# EAGLE design BLDC_ESC (EAGLE 9.5.2)
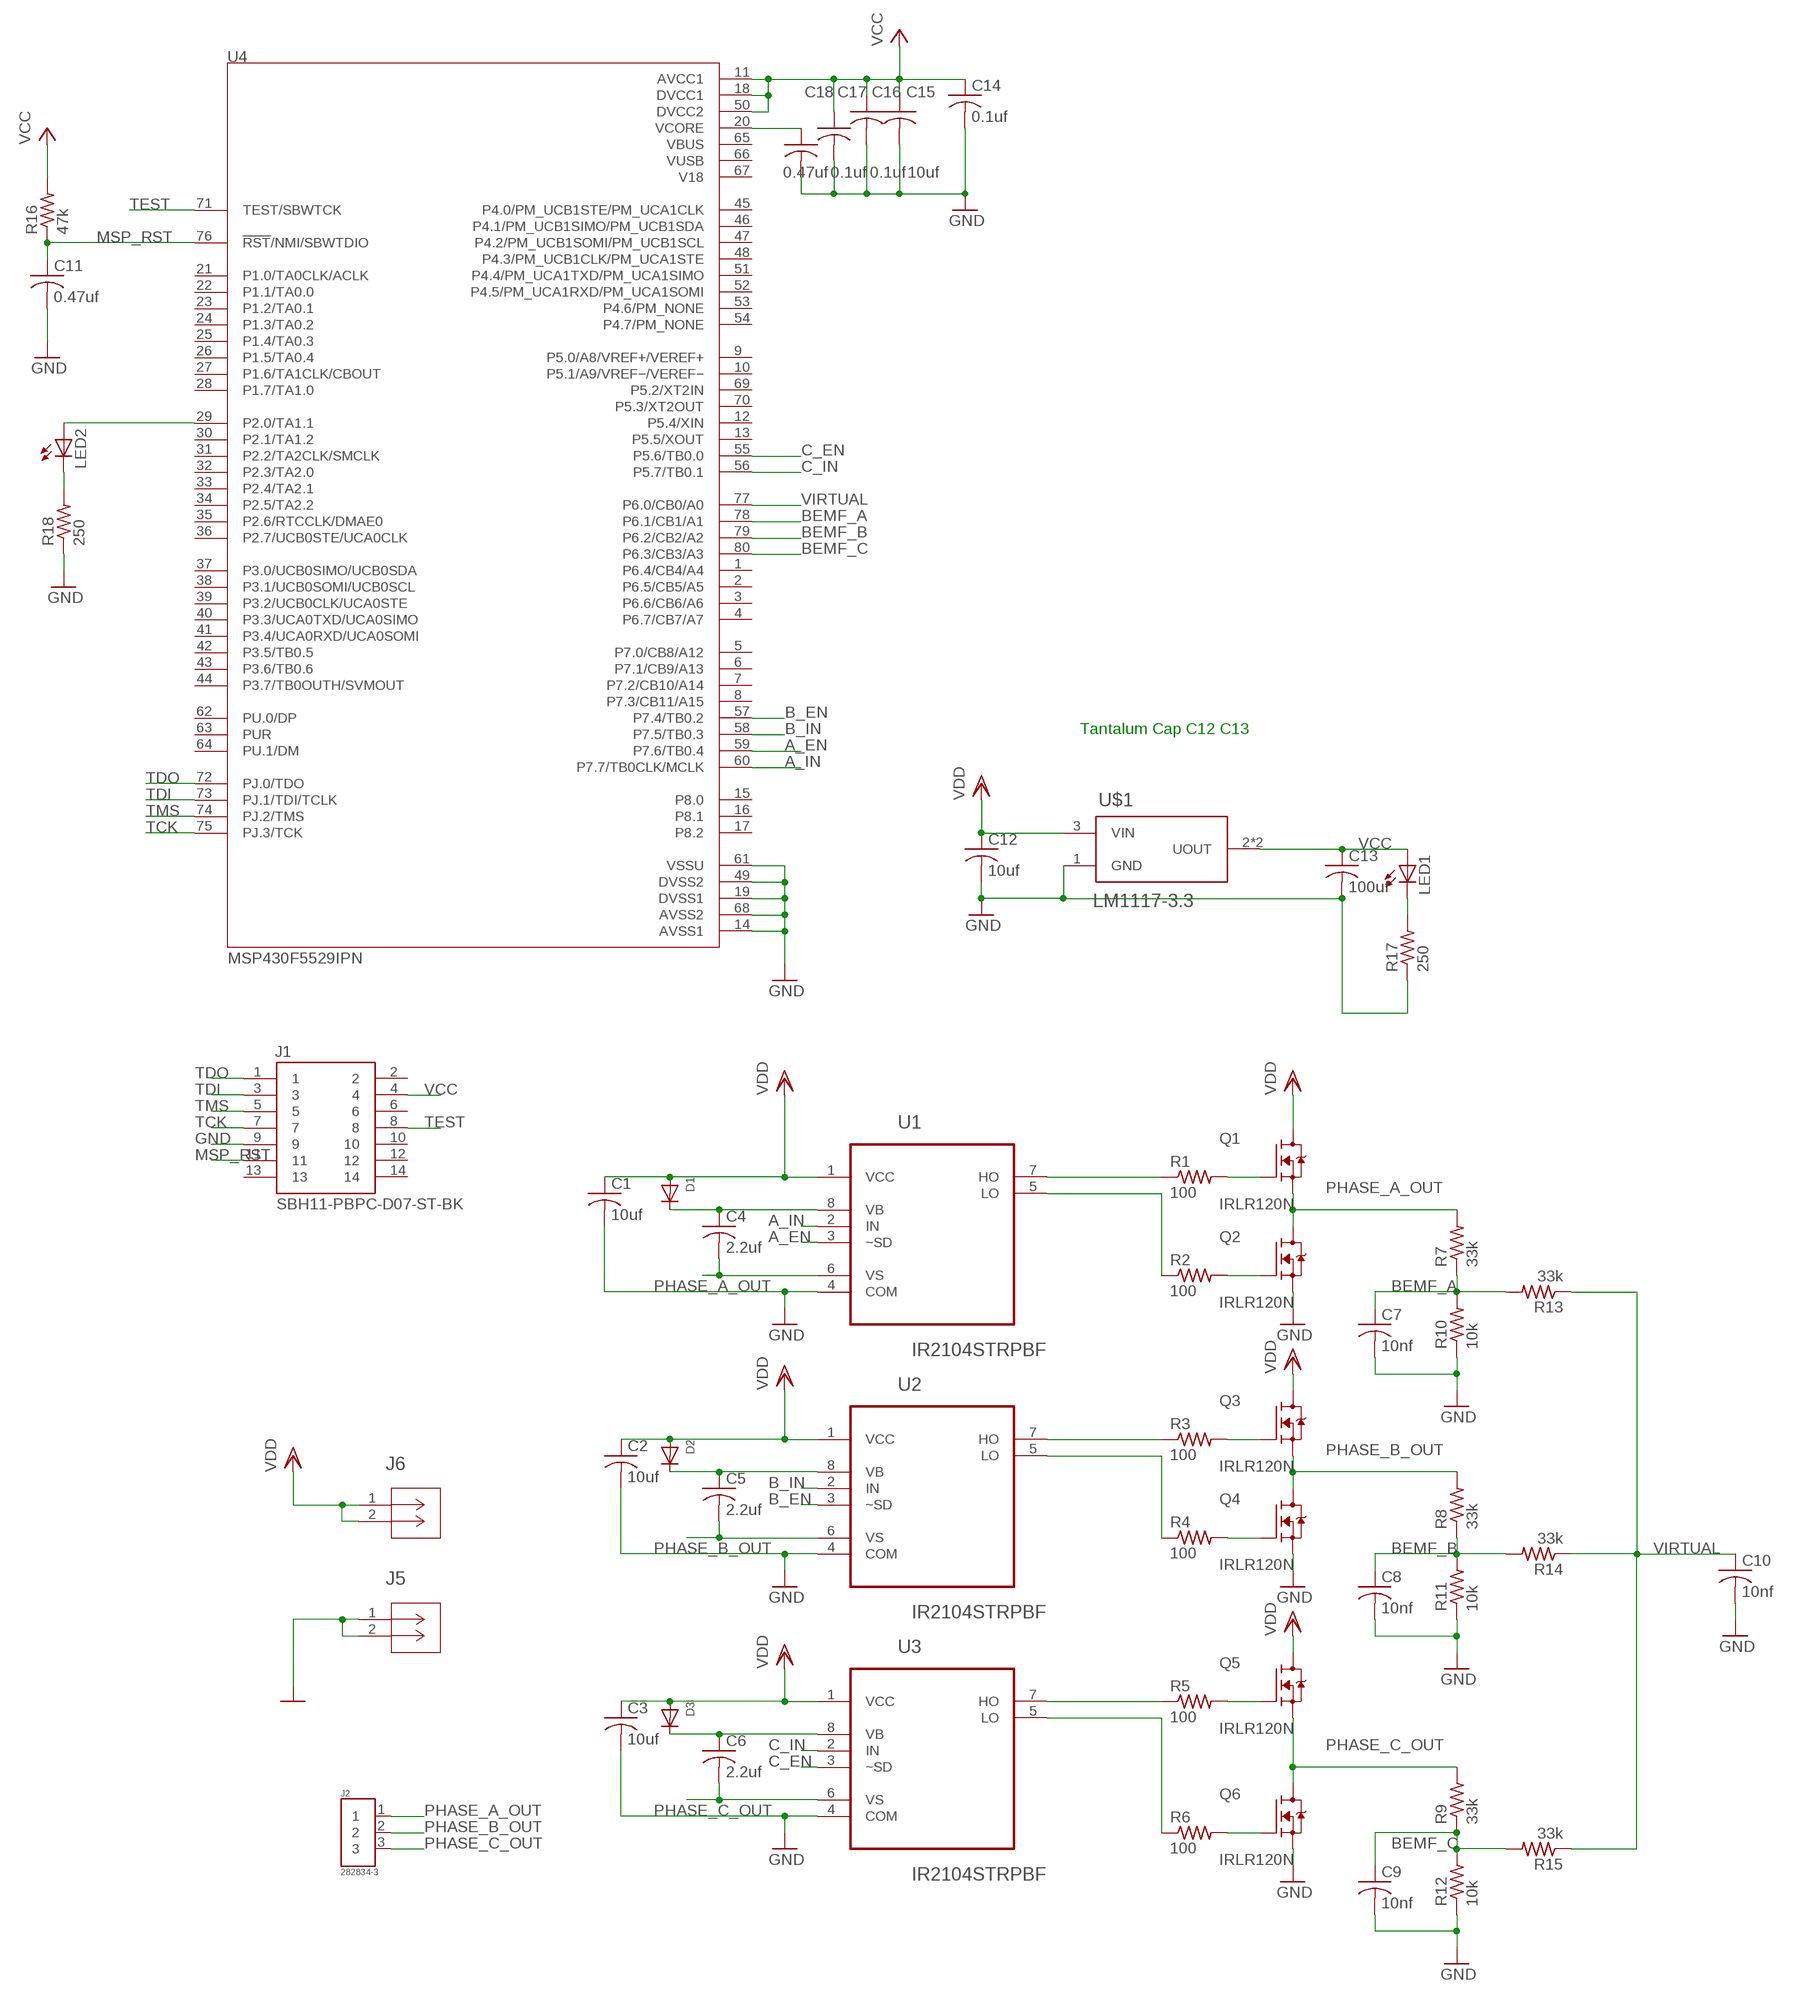
[diagram p0: schematic, sheet 1]

## Parts
C1  10uf  C-USC0805K  [C0805K]
C2  10uf  C-USC0805K  [C0805K]
C3  10uf  C-USC0805K  [C0805K]
C4  2.2uf  C-USC0805K  [C0805K]
C5  2.2uf  C-USC0805K  [C0805K]
C6  2.2uf  C-USC0805K  [C0805K]
C7  10nf  C-USC0805  [C0805]
C8  10nf  C-USC0805  [C0805]
C9  10nf  C-USC0805  [C0805]
C10  10nf  C-USC0805  [C0805]
C11  0.47uf  C-USC0805  [C0805]
C12  10uf  C-USC0805  [C0805]
C13  100uf  C-USC0805  [C0805]
C14  0.1uf  C-USC0805  [C0805]
C15  10uf  C-USC0805  [C0805]
C16  0.1uf  C-USC0805  [C0805]
C17  0.1uf  C-USC0805  [C0805]
C18  0.47uf  C-USC0805  [C0805]
D1  DIODESOD-123  [SOD-123]
D2  DIODESOD-123  [SOD-123]
D3  DIODESOD-123  [SOD-123]
J1  SBH11-PBPC-D07-ST-BK  [SULLINS_SBH11-PBPC-D07-ST-BK]
J2  282834-3  [TE_282834-3]
J5  105-1103-001  [CONN_105-1102-001]
J6  105-1103-001  [CONN_105-1102-001]
LED1  LEDCHIPLED_0805  [CHIPLED_0805]
LED2  LEDCHIPLED_0805  [CHIPLED_0805]
Q1  IRLR120N  [DPAK229P990X239-3N]
Q2  IRLR120N  [DPAK229P990X239-3N]
Q3  IRLR120N  [DPAK229P990X239-3N]
Q4  IRLR120N  [DPAK229P990X239-3N]
Q5  IRLR120N  [DPAK229P990X239-3N]
Q6  IRLR120N  [DPAK229P990X239-3N]
R1  100  R-US_R0805  [R0805]
R2  100  R-US_R0805  [R0805]
R3  100  R-US_R0805  [R0805]
R4  100  R-US_R0805  [R0805]
R5  100  R-US_R0805  [R0805]
R6  100  R-US_R0805  [R0805]
R7  33k  R-US_R0805  [R0805]
R8  33k  R-US_R0805  [R0805]
R9  33k  R-US_R0805  [R0805]
R10  10k  R-US_R0805  [R0805]
R11  10k  R-US_R0805  [R0805]
R12  10k  R-US_R0805  [R0805]
R13  33k  R-US_R0805  [R0805]
R14  33k  R-US_R0805  [R0805]
R15  33k  R-US_R0805  [R0805]
R16  47k  R-US_M0805  [M0805]
R17  250  R-US_R0805  [R0805]
R18  250  R-US_R0805  [R0805]
U1  IR2104STRPBF  [SOIC127P600X175-8N]
U2  IR2104STRPBF  [SOIC127P600X175-8N]
U3  IR2104STRPBF  [SOIC127P600X175-8N]
U4  MSP430F5529IPN  [QFP50P1400X1400X160-80N]
U$1  LM1117-3.3  [SOT-223]

## Nets
A_EN: U1.3(~SD) U4.59(P7.6/TB0.4)
A_IN: U1.2(IN) U4.60(P7.7/TB0CLK/MCLK)
B_EN: U2.3(~SD) U4.57(P7.4/TB0.2)
B_IN: U2.2(IN) U4.58(P7.5/TB0.3)
BEMF_A: C7.1 R7.1 R10.2 R13.2 U4.78(P6.1/CB1/A1)
BEMF_B: C8.1 R8.1 R11.2 R14.2 U4.79(P6.2/CB2/A2)
BEMF_C: C9.1 R9.1 R12.2 R15.2 U4.80(P6.3/CB3/A3)
C_EN: U3.3(~SD) U4.55(P5.6/TB0.0)
C_IN: U3.2(IN) U4.56(P5.7/TB0.1)
GND: C1.2 C2.2 C3.2 C7.2 C8.2 C9.2 C10.2 C11.2 C12.2 C13.2 C14.2 C15.2 C16.2 C17.2 C18.2 J1.9 J5.1 J5.2 Q2.2(S) Q4.2(S) Q6.2(S) R10.1 R11.1 R12.1 R17.1 R18.1 U1.4(COM) U2.4(COM) U3.4(COM) U4.14(AVSS1) U4.19(DVSS1) U4.49(DVSS2) U4.61(VSSU) U4.68(AVSS2) U$1.1(GND)
MSP_RST: C11.1 J1.11 R16.1 U4.76(!RST!/NMI/SBWTDIO)
N$1: Q1.1(G) R1.2
N$2: R1.1 U1.7(HO)
N$3: R2.1 U1.5(LO)
N$4: Q2.1(G) R2.2
N$5: C6.1 D3.C U3.8(VB)
N$6: C5.1 D2.C U2.8(VB)
N$7: C4.1 D1.C U1.8(VB)
N$8: R3.1 U2.7(HO)
N$9: Q3.1(G) R3.2
N$10: R4.1 U2.5(LO)
N$11: Q4.1(G) R4.2
N$12: R5.1 U3.7(HO)
N$13: Q5.1(G) R5.2
N$14: R6.1 U3.5(LO)
N$15: Q6.1(G) R6.2
N$16: LED1.C R17.2
N$17: LED2.A U4.29(P2.0/TA1.1)
N$18: LED2.C R18.2
N$19: C18.1 U4.20(VCORE)
PHASE_A_OUT: C4.2 J2.1 Q1.2(S) Q2.3(D) R7.2 U1.6(VS)
PHASE_B_OUT: C5.2 J2.2 Q3.2(S) Q4.3(D) R8.2 U2.6(VS)
PHASE_C_OUT: C6.2 J2.3 Q5.2(S) Q6.3(D) R9.2 U3.6(VS)
TCK: J1.7 U4.75(PJ.3/TCK)
TDI: J1.3 U4.73(PJ.1/TDI/TCLK)
TDO: J1.1 U4.72(PJ.0/TDO)
TEST: J1.8 U4.71(TEST/SBWTCK)
TMS: J1.5 U4.74(PJ.2/TMS)
VCC: C13.1 C14.1 C15.1 C16.1 C17.1 J1.4 LED1.A R16.2 U4.11(AVCC1) U4.18(DVCC1) U4.50(DVCC2) U$1.2(UOUT) U$1.4(UOUT)
VDD: C1.1 C2.1 C3.1 C12.1 D1.A D2.A D3.A J6.1 J6.2 Q1.3(D) Q3.3(D) Q5.3(D) U1.1(VCC) U2.1(VCC) U3.1(VCC) U$1.3(VIN)
VIRTUAL: C10.1 R13.1 R14.1 R15.1 U4.77(P6.0/CB0/A0)
Unconnected: J1.2 J1.6 J1.10 J1.12 J1.13 J1.14 U4.1(P6.4/CB4/A4) U4.2(P6.5/CB5/A5) U4.3(P6.6/CB6/A6) U4.4(P6.7/CB7/A7) U4.5(P7.0/CB8/A12) U4.6(P7.1/CB9/A13) U4.7(P7.2/CB10/A14) U4.8(P7.3/CB11/A15) U4.9(P5.0/A8/VREF+/VEREF+) U4.10(P5.1/A9/VREF−/VEREF−) U4.12(P5.4/XIN) U4.13(P5.5/XOUT) U4.15(P8.0) U4.16(P8.1) U4.17(P8.2) U4.21(P1.0/TA0CLK/ACLK) U4.22(P1.1/TA0.0) U4.23(P1.2/TA0.1) U4.24(P1.3/TA0.2) U4.25(P1.4/TA0.3) U4.26(P1.5/TA0.4) U4.27(P1.6/TA1CLK/CBOUT) U4.28(P1.7/TA1.0) U4.30(P2.1/TA1.2) U4.31(P2.2/TA2CLK/SMCLK) U4.32(P2.3/TA2.0) U4.33(P2.4/TA2.1) U4.34(P2.5/TA2.2) U4.35(P2.6/RTCCLK/DMAE0) U4.36(P2.7/UCB0STE/UCA0CLK) U4.37(P3.0/UCB0SIMO/UCB0SDA) U4.38(P3.1/UCB0SOMI/UCB0SCL) U4.39(P3.2/UCB0CLK/UCA0STE) U4.40(P3.3/UCA0TXD/UCA0SIMO) U4.41(P3.4/UCA0RXD/UCA0SOMI) U4.42(P3.5/TB0.5) U4.43(P3.6/TB0.6) U4.44(P3.7/TB0OUTH/SVMOUT) U4.45(P4.0/PM_UCB1STE/PM_UCA1CLK) U4.46(P4.1/PM_UCB1SIMO/PM_UCB1SDA) U4.47(P4.2/PM_UCB1SOMI/PM_UCB1SCL) U4.48(P4.3/PM_UCB1CLK/PM_UCA1STE) U4.51(P4.4/PM_UCA1TXD/PM_UCA1SIMO) U4.52(P4.5/PM_UCA1RXD/PM_UCA1SOMI) U4.53(P4.6/PM_NONE) U4.54(P4.7/PM_NONE) U4.62(PU.0/DP) U4.63(PUR) U4.64(PU.1/DM) U4.69(P5.2/XT2IN) U4.70(P5.3/XT2OUT)

## Notes on the sheet
- Tantalum Cap C12 C13

## Power pins joined to a net without a drawn wire
V18: U4.67(V18)
VBUS: U4.65(VBUS)
VUSB: U4.66(VUSB)

## Library data of the parts
C1-C6 C12-C18 = adafruit:C-US: CAPACITOR, American symbol
C7-C11 = rcl:C-US: CAPACITOR, American symbol; SPICEPREFIX: C
D1-D3 = adafruit:DIODE: Diode SMADIODE - SMA Surface Mount Package 20V 1A Schottky Diode Digikey: 641-1014-6-ND DO-1N4148 - Through Hole Small Current Diode SOD-123 20V 1 A (.5mV Vf) Schottky Diode - Digikey: MBRX120TPMSCT-ND SOD-323 10V 570mA (.38mV Vf, 3ns) Schottky Diode - Digikey: ZLLS410CT-ND SOD-523 30V 30mA Schottky Diode (RB751S-40TE61) - Digikey: RB751S-40TE61CT-ND SOT23-R/W - SOT23 Package (R = Solder Paste/Reflow Ovens, W = Hand-Soldering) BAT54Film 40V 300mA - Digikey: 497-7162-1-ND
J1 = SBH11-PBPC-D07-ST-BK:SBH11-PBPC-D07-ST-BK: 14 Position Total Dual Row 2.54 mm Pitch Straight Male Shrouded Box Header; DESCRIPTION: Connector Header Through Hole 14 position 0.100 (2.54mm); DIGI-KEY_PART_NUMBER: S9170-ND; DIGIKEY-PURCHASE-URL: https://snapeda.com/shop?store=DigiKey&id=229418; MF: Sullins Connector; MP: SBH11-PBPC-D07-ST-BK; PACKAGE: None
J2 = 282834-3:282834-3: Conn; Term Blk; PCB; Wire Receptacle; 3; 2.54mm; 30-16AWG; Green; 10A; 150V; M1.6; ARROW_AMERICAS-PURCHASE-URL: https://snapeda.com/shop?store=Arrow+Americas&id=398089; COMMENT: 282834-3; DESCRIPTION: 3 Position Wire to Board Terminal Block Horizontal with Board 0.100 (2.54mm); DIGI-KEY_PART_NUMBER: A98334-ND; DIGIKEY-PURCHASE-URL: https://snapeda.com/shop?store=DigiKey&id=398089; EU_ROHS_COMPLIANCE: Compliant with Exemptions; MF: TE Connectivity; MOUSER-PURCHASE-URL: https://snapeda.com/shop?store=Mouser&id=398089; MP: 282834-3; PACKAGE: None
J5 J6 = CinchConnectivitySolution:105-1103-001; BUILT_BY: EMA_Matt; COPYRIGHT: Copyright (C) 2018 Accelerated Designs. All rights reserved; MANUFACTURER_PART_NUMBER: 105-1103-001; SOURCELIBRARY: Cinch_Connectivity_Solutions_2019-12-17; VENDOR: Cinch Connectivity Solutions
LED1 LED2 = adafruit:LED: LED OSRAM: - CHIPLED LG R971, LG N971, LY N971, LG Q971, LY Q971, LO R971, LY R971 LH N974, LH R974 LS Q976, LO Q976, LY Q976 LO Q996 - Hyper CHIPLED LW Q18S LB Q993, LB Q99A, LB R99A - SideLED LS A670, LO A670, LY A670, LG A670, LP A670 LB A673, LV A673, LT A673, LW A673 LH A674 LY A675 LS A676, LA A676, LO A676, LY A676, LW A676 LS A679, LY A679, LG A679 - Hyper Micro SIDELED® LS Y876, LA Y876, LO Y876, LY Y876 LT Y87S - SmartLED LW L88C, LW L88S LB L89C, LB L89S, LG L890 LS L89K, LO L89K, LY L89K LS L896, LA L896, LO L896, LY L896 - TOPLED LS T670, LO T670, LY T670, LG T670, LP T670 LSG T670, LSP T670, LSY T670, LOP T670, LYG T670 LG T671, LOG T671, LSG T671 LB T673, LV T673, LT T673, LW T673 LH T674 LS T676, LA T676, LO T676, LY T676, LB T676, LH T676, LSB T676, LW T676 LB T67C, LV T67C, LT T67C, LS T67K, LO T67K, LY T67K, LW E67C LS E67B, LA E67B, LO E67B, LY E67B, LB E67C, LV E67C, LT E67C LW T67C LS T679, LY T679, LG T679 LS T770, LO T770, LY T770, LG T770, LP T770 LB T773, LV T773, LT T773, LW T773 LH T774 LS E675, LA E675, LY E675, LS T675 LS T776, LA T776, LO T776, LY T776, LB T776 LHGB T686 LT T68C, LB T68C - Hyper Mini TOPLED® LB M676 - Mini TOPLED Santana® LG M470 LS M47K, LO M47K, LY M47K Source: http://www.osram.convergy.de/
Q1-Q6 = IRLR120N:IRLR120N: 100V Single N-Channel HEXFET Power MOSFET in a D-Pak package; DESCRIPTION: 100V Single N-Channel HEXFET Power MOSFET in a D-Pak package; DIGI-KEY_PART_NUMBER: IRLR120NPBFCT-ND; DIGI-KEY_PURCHASE_URL: https://www.digikey.com/product-detail/en/infineon-technologies/IRLR120NTRPBF/IRLR120NPBFCT-ND/812548?utm_source=snapeda&utm_medium=aggregator&utm_campaign=symbol; MF: Infineon Technologies; MP: IRLR120N; PACKAGE: TO-252 International Rectifier
R1-R18 = adafruit:R-US_: RESISTOR, American symbol
U1-U3 = IR2104STRPBF:IR2104STRPBF: HALF-BRIDGE DRIVER; DESCRIPTION: Half Bridge Driver, Single Input Plus Inverting Shutdown Pin, Fixed 520ns Deadtime in a 8-Lead package; DIGI-KEY_PART_NUMBER: IR2104SPBFCT-ND; DIGI-KEY_PURCHASE_URL: https://www.digikey.com/product-detail/en/infineon-technologies/IR2104STRPBF/IR2104SPBFCT-ND/812609?utm_source=snapeda&utm_medium=aggregator&utm_campaign=symbol; MF: Infineon Technologies; MP: IR2104STRPBF; PACKAGE: SOIC-8 Infineon
U4 = MSP430F5529IPN:MSP430F5529IPN: 16-Bit Ultra-Low-Power Microcontroller, 128KB Flash, 8KB RAM, USB, 12Bit ADC, 2 USCIs, 32Bit HW MPY 80-LQFP -40 to 85; ARROW_AMERICAS-PURCHASE-URL: https://snapeda.com/shop?store=Arrow+Americas&id=100005; AVAILABILITY: Unavailable; DESCRIPTION: CPUXV2 MSP430F5xx Microcontroller IC 16-Bit 25MHz 128KB (128K x 8) FLASH 80-LQFP (12x12); DIGIKEY-PURCHASE-URL: https://snapeda.com/shop?store=DigiKey&id=100005; MF: Texas Instruments; MOUSER-PURCHASE-URL: https://snapeda.com/shop?store=Mouser&id=100005; MP: MSP430F5529IPN; PACKAGE: LQFP-80 Texas Instruments; PRICE: None
U$1 = LM1117-3.3:LM1117-3.3; AVAILABILITY: Unavailable; DESCRIPTION: Linear Voltage Regulator IC 1 Output 800mA SOT-223-4; MF: Texas Instruments; MP: LM1117-3.3; PACKAGE: SOT-223-4 Texas Instruments; PRICE: None

## Board
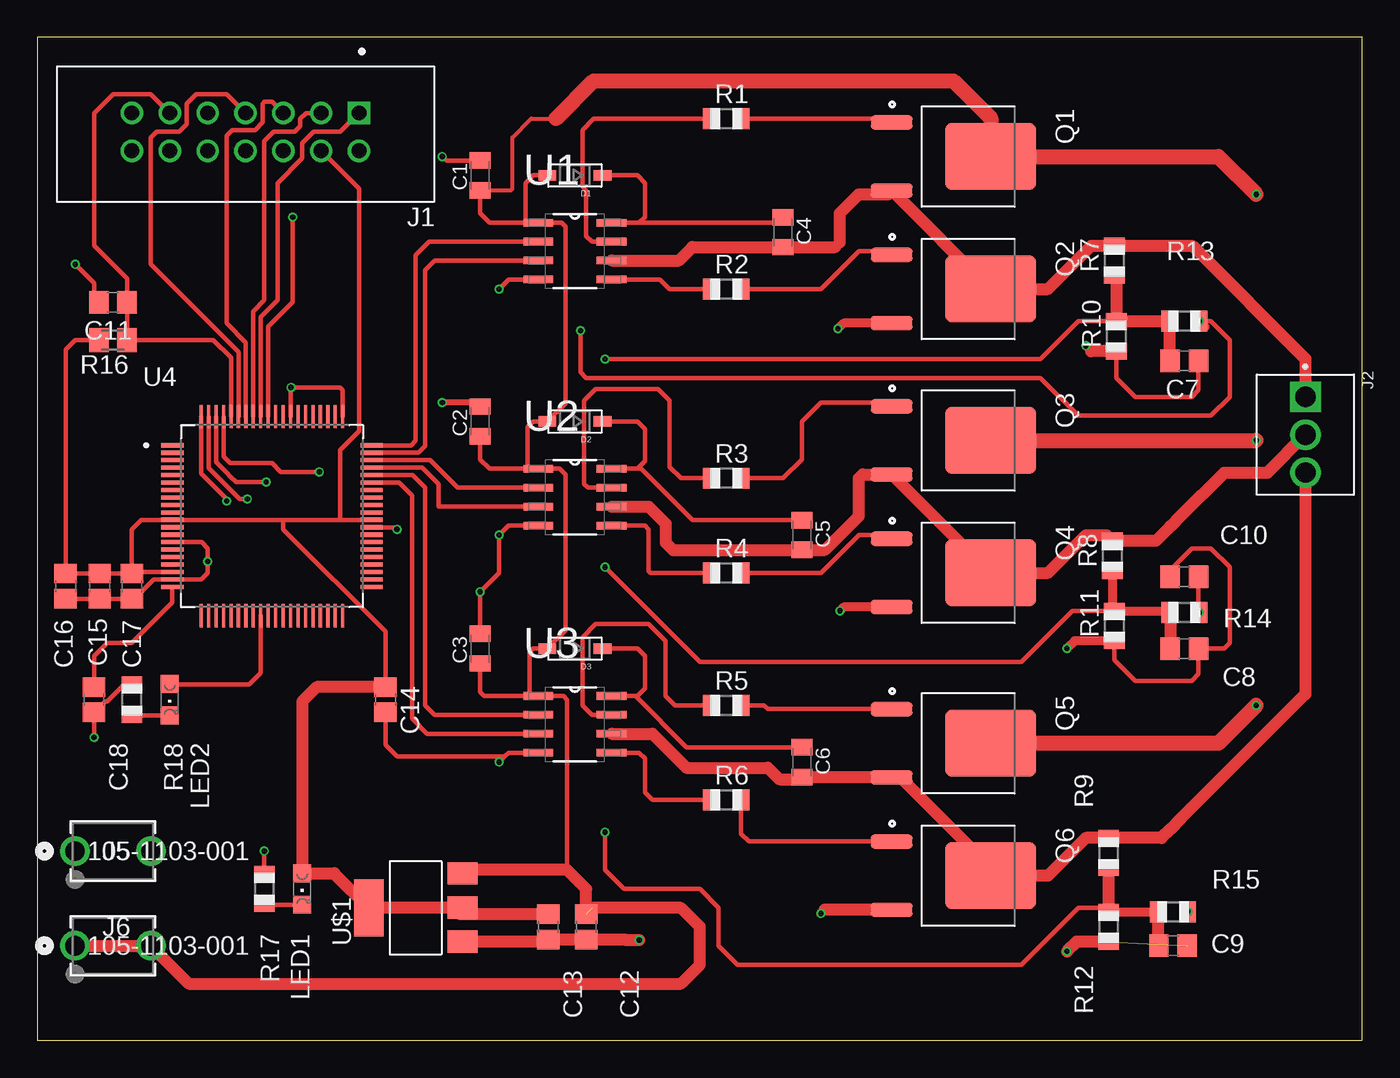
[diagram p1: board, top side]
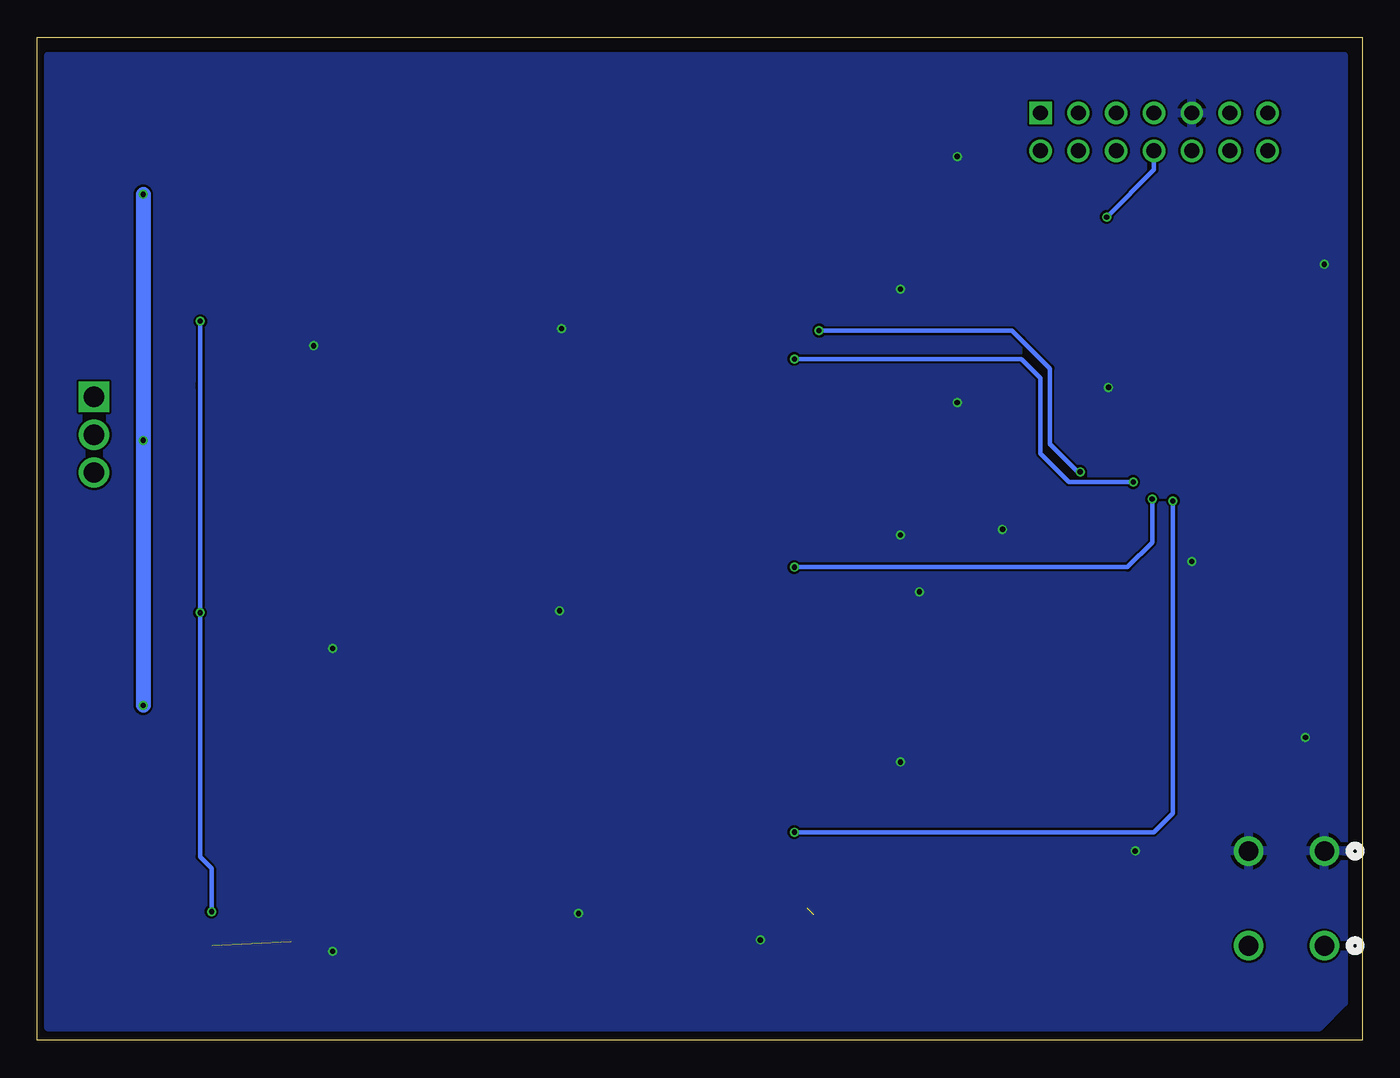
[diagram p2: board, bottom side, seen from below]

Size 88.9 x 67.31 mm. Coordinates in mm from the lower left corner, seen from the top.
Outline: 0,0 88.9,0 88.9,67.31 0,67.31 0,0
Copper layers (1*16): Top 0.035559375mm / dielectric 1.6mm / Bottom 0.035559375mm
Design rules "oshpark-2layer": minimum track width 6mil, minimum drill 10mil, track to track 6mil, track to pad 6mil, pad to pad 6mil, via to via 6mil, smd to smd 6mil, copper to edge 15mil, drill to drill 6mil, minimum pad ring 5mil, minimum via ring 5mil, stop-mask expansion 2.5mil, vias tented up to drill 0mil, thermal gap 10mil

### Footprints (pad centres in the part's own frame; a part is rotated, then mirrored left to right if it is on the bottom)
C0805K = smd 1.1 x 1.4: 1 -1,0; 2 1,0
C0805 = smd 1.3 x 1.5: 1 -0.95,0; 2 0.95,0
C0805' = smd 1.3 x 1.5: 1 -0.85,0; 2 0.85,0
SOD-123 = smd 1.2 x 0.7: A 1.85,0; C -1.85,0
SULLINS_SBH11-PBPC-D07-ST-BK = drill 1 square: 1 -7.62,-1.27 | drill 1: 2 -7.62,1.27; 3 -5.08,-1.27; 4 -5.08,1.27; 5 -2.54,-1.27; 6 -2.54,1.27; 7 0,-1.27; 8 0,1.27; 9 2.54,-1.27; 10 2.54,1.27; 11 5.08,-1.27; 12 5.08,1.27; 13 7.62,-1.27; 14 7.62,1.27
TE_282834-3 = drill 1.36 square: 1 0,0 | drill 1.36: 2 2.54,0; 3 5.08,0
CONN_105-1102-001 = drill 1.321 pad 1.829: 1 0,0; 2 5.08,0
CHIPLED_0805 = smd 1.2 x 1.2: A 0,-1.05; C 0,1.05
DPAK229P990X239-3N = smd 0.97 x 2.83: 1 -2.29,-4.14; 2 2.29,-4.14 | smd 4.49 x 6.1: 3 0,2.51
R0805 = smd 1.1 x 1.4: 1 -1,0; 2 1,0
M0805 = smd 1.3 x 1.6: 1 -0.95,0; 2 0.95,0
SOIC127P600X175-8N = smd 1.981 x 0.508: 1 -2.464,1.905; 2 -2.464,0.635; 3 -2.464,-0.635; 4 -2.464,-1.905; 5 2.464,-1.905; 6 2.464,-0.635; 7 2.464,0.635; 8 2.464,1.905
QFP50P1400X1400X160-80N = smd 1.56 x 0.28: 1 -6.68,4.75; 2 -6.68,4.25; 3 -6.68,3.75; 4 -6.68,3.25; 5 -6.68,2.75; 6 -6.68,2.25; 7 -6.68,1.75; 8 -6.68,1.25; 9 -6.68,0.75; 10 -6.68,0.25; 11 -6.68,-0.25; 12 -6.68,-0.75; 13 -6.68,-1.25; 14 -6.68,-1.75; 15 -6.68,-2.25; 16 -6.68,-2.75; 17 -6.68,-3.25; 18 -6.68,-3.75; 19 -6.68,-4.25; 20 -6.68,-4.75; 41 6.68,-4.75; 42 6.68,-4.25; 43 6.68,-3.75; 44 6.68,-3.25; 45 6.68,-2.75; 46 6.68,-2.25; 47 6.68,-1.75; 48 6.68,-1.25; 49 6.68,-0.75; 50 6.68,-0.25; 51 6.68,0.25; 52 6.68,0.75; 53 6.68,1.25; 54 6.68,1.75; 55 6.68,2.25; 56 6.68,2.75; 57 6.68,3.25; 58 6.68,3.75; 59 6.68,4.25; 60 6.68,4.75 | smd 0.28 x 1.56: 21 -4.75,-6.68; 22 -4.25,-6.68; 23 -3.75,-6.68; 24 -3.25,-6.68; 25 -2.75,-6.68; 26 -2.25,-6.68; 27 -1.75,-6.68; 28 -1.25,-6.68; 29 -0.75,-6.68; 30 -0.25,-6.68; 31 0.25,-6.68; 32 0.75,-6.68; 33 1.25,-6.68; 34 1.75,-6.68; 35 2.25,-6.68; 36 2.75,-6.68; 37 3.25,-6.68; 38 3.75,-6.68; 39 4.25,-6.68; 40 4.75,-6.68; 61 4.75,6.68; 62 4.25,6.68; 63 3.75,6.68; 64 3.25,6.68; 65 2.75,6.68; 66 2.25,6.68; 67 1.75,6.68; 68 1.25,6.68; 69 0.75,6.68; 70 0.25,6.68; 71 -0.25,6.68; 72 -0.75,6.68; 73 -1.25,6.68; 74 -1.75,6.68; 75 -2.25,6.68; 76 -2.75,6.68; 77 -3.25,6.68; 78 -3.75,6.68; 79 -4.25,6.68; 80 -4.75,6.68
SOT-223 = smd 1.499 x 2.007: 1 -2.261,-3.15; 2 0.025,-3.15; 3 2.311,-3.15 | smd 3.81 x 2.007: 4 0,3.15

### Placement (x,y rotation side)
C1  29.72,58.04 90 top
C2  29.72,41.53 90 top
C3  29.72,26.29 90 top
C4  50.04,54.23 270 top
C5  51.31,33.91 270 top
C6  51.31,18.67 270 top
C7  76.96,45.59 0 top
C8  76.96,26.29 0 top
C9  76.2,6.35 0 top
C10  76.96,31.11 180 top
C11  5.08,49.53 180 top
C12  10uf  [C0805']  36.83,7.62 270 top
C13  100uf  [C0805']  34.29,7.62 270 top
C14  0.1uf  [C0805']  23.37,22.86 270 top
C15  10uf  [C0805']  4.19,30.48 270 top
C16  0.1uf  [C0805']  1.91,30.48 270 top
C17  0.1uf  [C0805']  6.35,30.48 270 top
C18  0.47uf  [C0805']  3.81,22.86 270 top
D1  36.07,58.04 180 top
D2  36.07,41.53 180 top
D3  36.07,26.29 180 top
J1  13.97,60.96 180 top
J2  85.09,43.18 270 top
J5  2.54,12.7 0 top
J6  2.54,6.35 0 top
LED1  17.78,10.16 180 top
LED2  8.89,22.86 180 top
Q1  61.47,59.31 270 top
Q2  61.47,50.42 270 top
Q3  61.47,40.26 270 top
Q4  61.47,31.37 270 top
Q5  61.47,19.94 270 top
Q6  61.47,11.05 270 top
R1  46.23,61.85 0 top
R2  46.23,50.42 0 top
R3  46.23,37.72 0 top
R4  46.23,31.37 0 top
R5  46.23,22.48 0 top
R6  46.23,16.13 0 top
R7  72.26,52.32 90 top
R8  72.14,32.51 90 top
R9  71.88,12.57 90 top
R10  72.39,47.24 90 top
R11  72.26,27.81 90 top
R12  71.88,7.62 90 top
R13  76.96,48.26 180 top
R14  76.96,28.7 180 top
R15  76.2,8.64 180 top
R16  5.08,46.99 180 top
R17  15.24,10.16 270 top
R18  6.35,22.86 270 top
U1  36.07,52.96 0 top
U2  36.07,36.45 0 top
U3  36.07,21.21 0 top
U4  15.75,35.18 0 top
U$1  25.4,8.89 90 top

### Tracks (layer width: path | path; a pad name or v marks a point on that pad's centre or on a via)
A_EN
  Top 0.305: U4.59 25.59,39.43 26.04,39.88 26.04,51.69 26.67,52.32 U1.3
A_IN
  Top 0.305: U4.60 25.07,39.93 25.4,40.26 25.4,52.7 26.29,53.59 U1.2
B_EN
  Top 0.305: U4.57 25.83,38.43 26.92,37.34 26.92,35.81 U2.3
B_IN
  Top 0.305: U4.58 26.35,38.93 28.19,37.08 U2.2
BEMF_A  (via drill 0.35)
  Top 0.305: U4.78 12,38.8 12.7,38.1 12.95,37.85 13.34,37.47 v15.37,37.47 | v38.1,45.72 67.31,45.72 69.85,48.26 72.37,48.26 R10.2
  Top 0.61: R7.1 72.39,51.2 | R13.2 75.95,48.24
  Top 0.813: 72.39,51.2 R10.2 75.95,48.24 | R13.2 75.96,45.64 C7.1
  Bottom 0.305: v15.37,37.47 19.68,37.47 21.59,39.37 21.59,44.45 22.86,45.72 v38.1,45.72
BEMF_B  (via drill 0.35)
  Top 0.305: U4.79 11.5,38.41 13.59,36.32 v14.1,36.32 | v38.1,31.75 44.45,25.4 66.04,25.4 69.45,28.81 R11.2
  Top 0.61: R8.1 72.14,28.94 R11.2 75.85,28.81 R14.2
  Top 0.813: R14.2 76.01,28.65 C8.1
  Bottom 0.305: v14.1,36.32 14.1,33.4 15.75,31.75 v38.1,31.75
BEMF_C  (via drill 0.35)
  Top 0.305: U4.80 11,38.02 12.7,36.32 v12.7,36.2 | v38.1,13.97 38.1,11.43 39.37,10.16 44.45,10.16 45.72,8.89 45.72,6.35 46.99,5.08 66.04,5.08 69.85,8.89 71.61,8.89 R12.2
  Top 0.61: R12.2 75.18,8.62 R15.2
  Top 0.813: R9.1 R12.2 | R15.2 75.2,6.4 C9.1
  Bottom 0.305: v12.7,36.2 12.7,15.24 13.97,13.97 v38.1,13.97
C_EN
  Top 0.305: U3.3 26.16,20.57 25.15,21.59 25.15,36.58 24.29,37.43 U4.55
C_IN
  Top 0.305: U4.56 25.19,37.93 26.04,37.08 26.04,22.48 26.67,21.84 U3.2
GND  (via drill 0.35)  (1 unrouted)
  Top 0.305: U3.4 31.62,19.3 31.37,19.05 | 31.37,19.05 v30.99,18.67 | C3.2 v29.72,30.1 30.99,31.37 v30.99,33.91 31.62,34.54 U2.4 | U1.4 31.62,51.05 v30.99,50.42 | C1.2 27.45,59.04 v27.18,59.31 | C16.2 C15.2 C17.2 6.52,29.63 7.82,30.93 U4.19 10.99,30.93 11.43,31.37 v11.43,32.13 11.43,33.02 11.02,33.43 U4.14 | R18.1 5.79,23.86 4.69,22.75 4.55,22.75 C18.2 v3.81,20.32 | C14.2 23.37,19.81 24.13,19.05 31.37,19.05 | R17.1 v15.24,12.7 | U4.49 23.99,34.43 v24.13,34.29 | C11.2 3.81,49.85 3.81,50.8 v2.54,52.07 | C7.2 77.91,43.62 77.47,43.18 73.66,43.18 72.39,44.45 R10.1 | R11.1 72.26,25.53 73.66,24.13 77.47,24.13 77.91,24.57 C8.2 79.63,26.29 80.01,26.67 80.01,31.75 78.74,33.02 77.47,33.02 76.01,31.56 C10.2 | U4.68 17,43.67 17.02,43.69 | 17.02,43.69 v17.02,43.81 | U4.61 20.5,43.64 20.32,43.81 17.14,43.81 17.02,43.69
  Top 0.406: C2.2 29.45,42.8 v27.18,42.8
  Top 0.508: C3.2
  Top 0.61: 52.83,8.76 v52.58,8.51 | Q4.2 54.1,29.08 v53.85,28.83 | R11.1 69.61,26.81 v69.09,26.29 | Q2.2 54.1,48.13 v53.72,47.75 | 70.72,46.24 v70.36,46.61
  Top 0.813: Q6.2 52.83,8.76 | R12.1 69.74,6.62 v69.09,5.97 | R10.1 70.72,46.24 | U$1.1 34.15,6.63 C13.2 C12.2 39.46,6.77 39.5,6.73 v40.39,6.73
  pour Bottom: 1.27,2.54 2.92,0.89 88.14,0.89 88.14,66.04 1.27,66.04
MSP_RST
  Top 0.305: U4.76 13,45.8 11.81,46.99 R16.1 C11.1 | 6.35,49.53 C11.1 | J1.11 7.62,63.5 5.08,63.5 3.81,62.23 3.81,53.34 6.03,51.12 C11.1
N$1
  Top 0.152: Q1.1 57.2,61.8 57.2,61.85
  Top 0.305: 57.08,61.85 Q1.1 | R1.2 57.2,61.85 57.66,61.85
N$2
  Top 0.305: R1.1 37.34,61.85 36.58,61.09 36.58,57.28 36.83,57.02 36.83,53.98 37.21,53.59 U1.7
N$3
  Top 0.305: U1.5 41.78,51.05 42.42,50.42 R2.1
N$4
  Top 0.305: R2.2 52.58,50.42 55.12,52.96 57.08,52.96 Q2.1
N$5
  Top 0.305: D3.C 40.26,26.29 40.77,25.78 40.77,23.62 40.26,23.11 U3.8 40.13,23.11 43.58,19.67 C6.1
N$6
  Top 0.305: D2.C 40.26,41.53 40.77,41.02 40.77,38.86 40.26,38.35 U2.8 40.51,38.35 43.96,34.91 C5.1
N$7
  Top 0.305: D1.C 40.26,58.04 40.77,57.53 40.77,55.24 40.39,54.86 | 40.39,54.86 U1.8 | 40.39,54.86 49.67,54.86 C4.1
N$8
  Top 0.305: R3.1 43.18,37.72 42.42,38.48 42.42,42.93 41.66,43.69 37.47,43.69 36.7,42.93 36.7,37.34 36.96,37.08 U2.7
N$9
  Top 0.305: R3.2 50.04,37.72 51.31,38.99 51.31,41.53 52.58,42.8 57.08,42.8 Q3.1
N$10
  Top 0.305: U2.5 40.77,34.54 41.02,34.29 41.02,31.5 41.15,31.37 R4.1
N$11
  Top 0.305: R4.2 52.58,31.37 55.12,33.91 57.08,33.91 Q4.1
N$12
  Top 0.305: R5.1 44.45,22.48 42.8,22.48 42.16,23.11 42.16,26.8 41.02,27.94 37.47,27.94 36.58,27.05 36.58,22.48 37.21,21.84 U3.7
N$13
  Top 0.305: Q5.1 49.02,22.23 48.77,22.48 R5.2
N$14
  Top 0.305: U3.5 40.39,19.3 40.77,18.92 40.77,16.64 41.27,16.13 R6.1
N$15
  Top 0.305: Q6.1 47.75,13.34 47.23,13.86 R6.2
N$16
  Top 0.305: LED1.C 15.29,9.11 R17.2
N$17
  Top 0.305: U4.29 15,24.65 14.22,23.88 8.92,23.88 LED2.A
N$18
  Top 0.305: R18.2 6.4,21.81 LED2.C
N$19
  Top 0.305: U4.20 9.07,29.39 6.35,26.67 4.7,26.67 3.81,25.78 C18.1
PHASE_A_OUT
  Top 0.152: Q2.3 64.06,50.52 63.93,50.42
  Top 0.61: 62.74,51.66 Q2.3 | 71.99,53.59 R7.2 71.63,53.32 | 63.93,50.42 Q2.3 | Q2.3 64.01,50.42 | Q1.2 57.08,56.77 | 53.54,53.23 53.85,53.54
  Top 0.813: U1.6 43.05,52.32 43.96,53.23 C4.2 53.54,53.23 | Q1.2 63.93,50.42 | Q2.3 67.82,50.42 70.72,53.32 71.63,53.32 | 57.08,56.77 55.12,56.77 53.85,55.5 53.85,53.54 | J2.1 85.09,45.72 77.49,53.32 R7.2
PHASE_B_OUT
  Top 0.305: 51.29,32.89 C5.2
  Top 0.61: Q4.3 63.99,31.35 63.94,31.35 | 71.74,33.91 R8.2
  Top 0.813: U2.6 41.02,35.81 42.16,34.67 42.16,33.4 42.67,32.89 51.29,32.89 | 63.94,31.35 Q3.2 55.37,37.97 55.12,37.72 55.12,35.18 52.85,32.91 C5.2 | Q4.3 67.82,31.37 70.36,33.91 71.74,33.91 | R8.2 75.04,33.51 76.01,34.48 76.71,35.18 79.63,38.1 82.55,38.1 J2.2
PHASE_C_OUT
  Top 0.152: Q5.2 57.51,17.75 57.9,17.67
  Top 0.305: 51.31,17.4 51.31,17.53 C6.2
  Top 0.61: 64.01,11.08 Q6.3 64.25,10.78 64.25,11.32
  Top 0.813: U3.6 41.27,20.57 43.56,18.29 49.02,18.29 49.78,17.53 51.31,17.53 | 57.9,17.67 64.25,11.32 | Q6.3 67.82,11.05 70.34,13.57 R9.2 75.42,13.57 76.01,14.16 76.71,14.86 85.09,23.24 J2.3 | Q5.2 51.33,17.65 C6.2
TCK
  Top 0.305: U4.75 13.5,46.19 7.62,52.07 7.62,60.58 8,60.96 9.53,60.96 10.03,61.47 10.03,62.87 10.67,63.5 12.7,63.5 J1.7
TDI
  Top 0.305: J1.3 18.03,62.23 17.65,61.85 17.65,61.34 17.27,60.96 15.88,60.96 15.24,60.33 15.24,49.66 14.48,48.9 14.48,41.88 U4.73
TDO
  Top 0.305: U4.72 15,48.53 16.13,49.66 16.13,57.53 17.78,59.18 17.78,60.2 18.54,60.96 20.32,60.96 J1.1
TEST  (via drill 0.35)
  Top 0.305: v17.14,55.24 17.14,49.53 15.49,47.88 U4.71
  Bottom 0.305: J1.8 13.97,58.42 v17.14,55.24
TMS
  Top 0.305: J1.5 15.75,62.99 15.24,62.99 15.11,62.87 15.11,61.59 14.61,61.09 13.08,61.09 12.7,60.71 12.7,48.13 14,46.84 U4.74
VCC
  Top 0.305: 33.84,8.91 C13.1 | U$1.2 28.52,8.89 | U4.18 6.45,31.43 C17.1 | C17.1 C15.1 C16.1 1.91,46.35 2.54,46.99 R16.2 | C17.1 6.35,34.29 6.99,34.92 U4.11 16.51,34.93 | 16.51,34.93 20.32,34.93 | 20.32,34.93 U4.50 | C14.1 23.37,27.43 16.51,34.29 16.51,34.93 | J1.4 21.59,57.15 21.59,40.89 20.32,39.62 20.32,34.93
  Top 0.813: 28.52,8.89 27.94,8.89 | 27.94,8.89 U$1.4 19.93,11.21 LED1.A 17.78,22.73 18.76,23.71 C14.1 | C13.1 28.36,8.47 27.94,8.89
VDD  (via drill 0.35)  (1 unrouted)
  Top 0.254: C1.1 31.77,57.04 31.88,57.15 31.88,60.58 33.15,61.85 34.8,61.85
  Top 0.305: 33.02,23.11 U3.1 35.31,23.11 35.56,22.86 35.56,15.24 | 33.02,23.11 29.97,23.11 29.72,23.37 C3.1 | 33.02,23.11 33.02,26.04 33.27,26.29 D3.A 35.43,27.5 35.43,37.97 35.05,38.35 U2.1 32.89,38.35 | 32.89,38.35 30.35,38.35 29.72,38.99 C2.1 | 32.89,38.35 32.89,41.15 33.27,41.53 D2.A 35.43,42.74 35.43,54.61 35.18,54.86 U1.1 32.77,54.86 | 32.77,54.86 30.35,54.86 29.72,55.5 C1.1 | 32.77,54.86 32.77,57.53 33.27,58.04 D1.A | 35.56,15.24 35.56,11.43 | 35.56,15.24
  Top 0.813: J6.1 J6.2 10.16,3.81 43.18,3.81 44.45,5.08 44.45,7.62 43.18,8.89 37.25,8.89 | C12.1 36.83,10.16 35.56,11.43 28.78,11.43 U$1.3
  Top 1.016: 34.8,61.85 37.34,64.39 61.47,64.39 63.98,61.88 Q1.3 79.25,59.31 v81.79,56.77 | v81.79,22.48 79.25,19.94 Q5.3 | Q3.3 v81.79,40.26
  Bottom 1.016: v81.79,56.77 v81.79,40.26 v81.79,22.48
VIRTUAL  (via drill 0.35)  (1 unrouted)
  Top 0.305: 77.98,48.24 R13.1 78.74,48.26 80.01,46.99 80.01,43.18 78.74,41.91 69.85,41.91 67.31,44.45 36.83,44.45 36.45,44.83 v36.45,47.62 | U4.77 12.5,39.19 12.95,38.73 15.75,38.73 16.34,38.15 v18.92,38.15 | C10.1 77.91,28.77 v77.98,28.7
  Top 0.61: R13.1 78.34,47.88
  Bottom 0.305: R15.1 77.2,11.54 77.98,12.32 v77.98,28.7 77.98,43.81 | 77.98,44.07 77.98,43.81 | R13.1 77.96,43.83 77.98,43.81 | v36.45,47.62 23.5,47.62 22.86,46.99 20.95,45.09 20.95,40.01 19.05,38.1 18.97,38.1 v18.92,38.15
  other vias: 77.2,8.64 77.96,48.26

### Text on the board
Top: TODO: PHASE OUT CONNECTORS! / VDD: 40 width